# EAGLE schematic FirstGame (EAGLE 6.5.0)
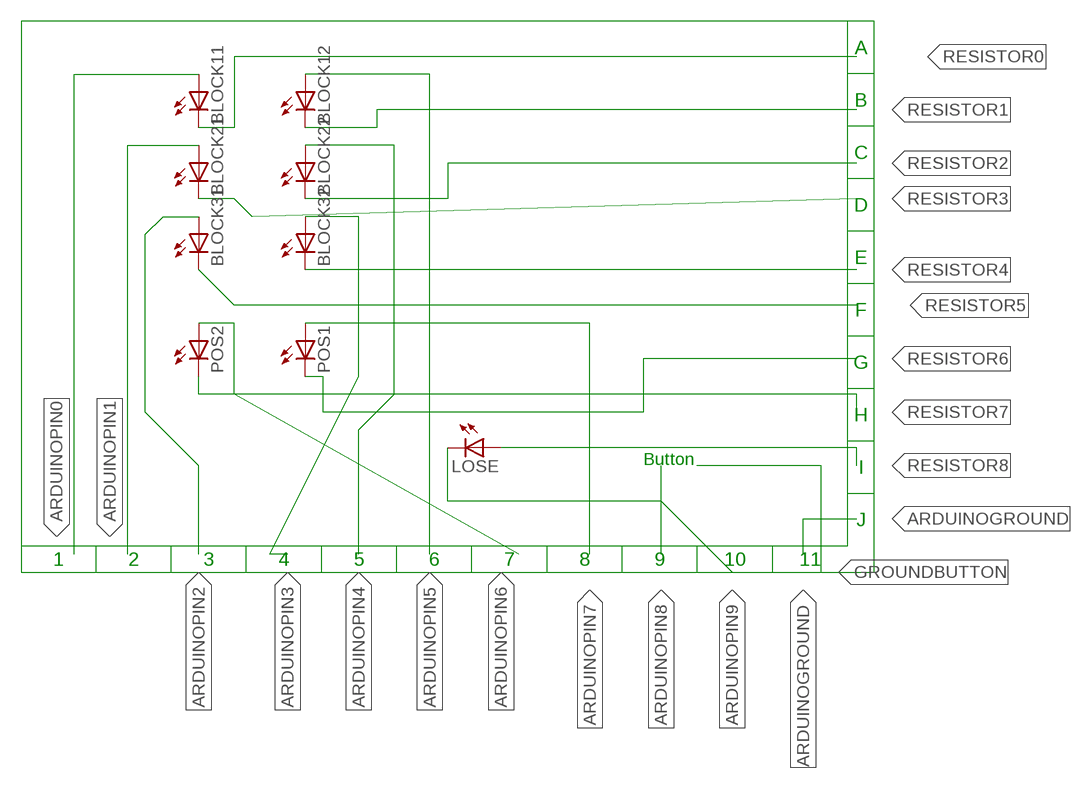
[diagram p0: schematic, sheet 1]

## Parts
BLOCK11  LED5MM  [LED5MM]
BLOCK12  LED5MM  [LED5MM]
BLOCK21  LED5MM  [LED5MM]
BLOCK22  LED5MM  [LED5MM]
BLOCK31  LED5MM  [LED5MM]
BLOCK32  LED5MM  [LED5MM]
LOSE  LED5MM  [LED5MM]
POS1  LED5MM  [LED5MM]
POS2  LED5MM  [LED5MM]

## Nets
ARDUINOPIN0: BLOCK11.A
ARDUINOPIN1: BLOCK21.A
ARDUINOPIN2: BLOCK31.A
ARDUINOPIN3: BLOCK32.A
ARDUINOPIN4: BLOCK22.A
ARDUINOPIN5: BLOCK12.A
ARDUINOPIN6: POS2.A
ARDUINOPIN7: POS1.A
ARDUINOPIN9: LOSE.K(C)
RESISTOR0: BLOCK11.K(C)
RESISTOR1: BLOCK12.K(C)
RESISTOR2: BLOCK22.K(C)
RESISTOR3: BLOCK21.K(C)
RESISTOR4: BLOCK32.K(C)
RESISTOR5: BLOCK31.K(C)
RESISTOR6: POS1.K(C)
RESISTOR7: POS2.K(C)
RESISTOR8: LOSE.A

## Notes on the sheet
- Button

## Library data of the parts
BLOCK11 BLOCK12 BLOCK21 BLOCK22 BLOCK31 BLOCK32 LOSE POS1 POS2 = led:LED: LED OSRAM: - CHIPLED LG R971, LG N971, LY N971, LG Q971, LY Q971, LO R971, LY R971 LH N974, LH R974 LS Q976, LO Q976, LY Q976 LO Q996 - Hyper CHIPLED LW Q18S LB Q993, LB Q99A, LB R99A - SideLED LS A670, LO A670, LY A670, LG A670, LP A670 LB A673, LV A673, LT A673, LW A673 LH A674 LY A675 LS A676, LA A676, LO A676, LY A676, LW A676 LS A679, LY A679, LG A679 - Hyper Micro SIDELED® LS Y876, LA Y876, LO Y876, LY Y876 LT Y87S - SmartLED LW L88C, LW L88S LB L89C, LB L89S, LG L890 LS L89K, LO L89K, LY L89K LS L896, LA L896, LO L896, LY L896 - TOPLED LS T670, LO T670, LY T670, LG T670, LP T670 LSG T670, LSP T670, LSY T670, LOP T670, LYG T670 LG T671, LOG T671, LSG T671 LB T673, LV T673, LT T673, LW T673 LH T674 LS T676, LA T676, LO T676, LY T676, LB T676, LH T676, LSB T676, LW T676 LB T67C, LV T67C, LT T67C, LS T67K, LO T67K, LY T67K, LW E67C LS E67B, LA E67B, LO E67B, LY E67B, LB E67C, LV E67C, LT E67C LW T67C LS T679, LY T679, LG T679 LS T770, LO T770, LY T770, LG T770, LP T770 LB T773, LV T773, LT T773, LW T773 LH T774 LS E675, LA E675, LY E675, LS T675 LS T776, LA T776, LO T776, LY T776, LB T776 LHGB T686 LT T68C, LB T68C - Hyper Mini TOPLED® LB M676 - Mini TOPLED Santana® LG M470 LS M47K, LO M47K, LY M47K Source: http://www.osram.convergy.de LUXEON: - LUMILED® LXK2-PW12-R00, LXK2-PW12-S00, LXK2-PW14-U00, LXK2-PW14-V00 LXK2-PM12-R00, LXK2-PM12-S00, LXK2-PM14-U00 LXK2-PE12-Q00, LXK2-PE12-R00, LXK2-PE12-S00, LXK2-PE14-T00, LXK2-PE14-U00 LXK2-PB12-K00, LXK2-PB12-L00, LXK2-PB12-M00, LXK2-PB14-N00, LXK2-PB14-P00, LXK2-PB14-Q00 LXK2-PR12-L00, LXK2-PR12-M00, LXK2-PR14-Q00, LXK2-PR14-R00 LXK2-PD12-Q00, LXK2-PD12-R00, LXK2-PD12-S00 LXK2-PH12-R00, LXK2-PH12-S00 LXK2-PL12-P00, LXK2-PL12-Q00, LXK2-PL12-R00 Source: www.luxeon.com KINGBRIGHT: KA-3528ASYC Source: www.kingbright.com